# Altium project ZEPIC.PrjPcb (part 1 of 2)
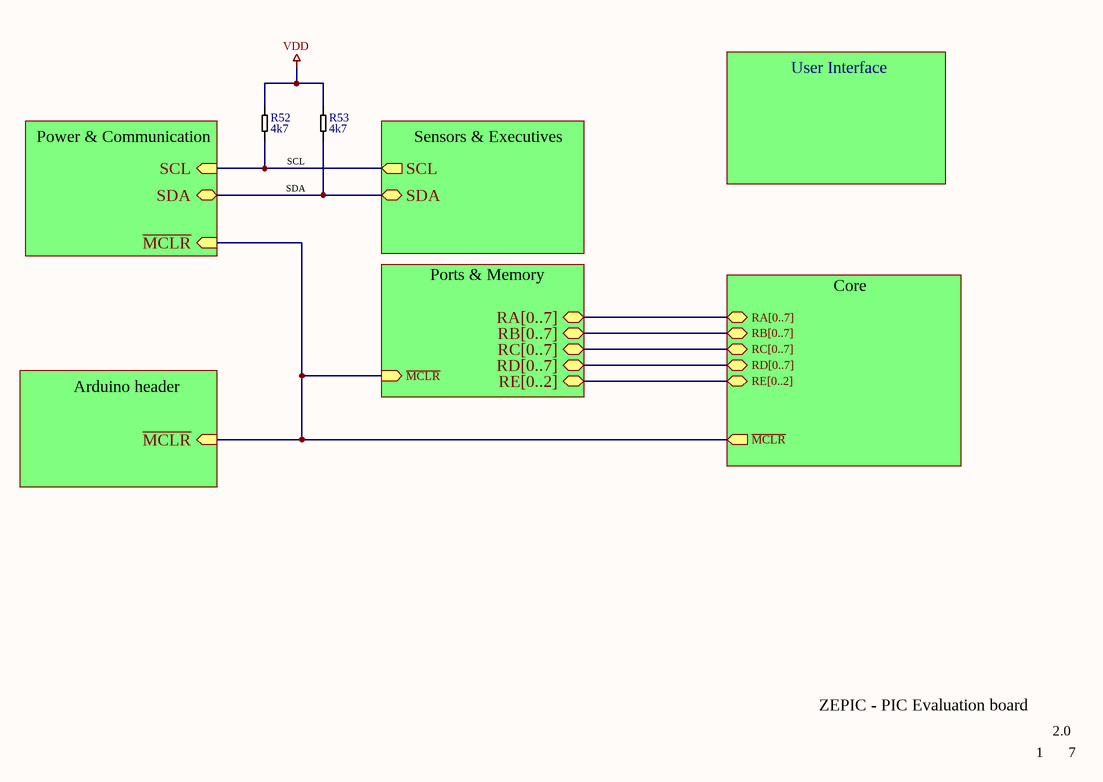
[diagram p0: mainSheet.SchDoc]
7 sheets, 209 parts. Net scope: hierarchical (ports join the sheet entries above them; power ports are global).
Board file: zepic.PcbDoc
Sheets:
  mainSheet.SchDoc
    Power & Communication = powerAndCommunication.SchDoc
    Core = core.SchDoc
    Arduino header = arduinoHeader.SchDoc
    User Interface = userInterface.SchDoc
    Ports & Memory = portsAndMemory.SchDoc
    Sensors & Executives = sensorsAndExecutiveElements.SchDoc

## Sheet mainSheet.SchDoc
size A4

### Parts
R52  Resistance: 4k7  [0805]  (hidden comment: Resistor)
R53  Resistance: 4k7  [0805]  (hidden comment: Resistor)

### Sub-sheets
Arduino header = arduinoHeader.SchDoc: ~{MCLR} (in)
Core = core.SchDoc: ~{MCLR} (out), RE[0..2] (bidir), RD[0..7] (bidir), RC[0..7] (bidir), RB[0..7] (bidir), RA[0..7] (bidir)
Ports & Memory = portsAndMemory.SchDoc: RE[0..2] (bidir), RD[0..7] (bidir), RC[0..7] (bidir), RB[0..7] (bidir), RA[0..7] (bidir), ~{MCLR} (in)
Power & Communication = powerAndCommunication.SchDoc: ~{MCLR} (in), SCL (in), SDA (bidir)
Sensors & Executives = sensorsAndExecutiveElements.SchDoc: SCL (out), SDA (bidir)
User Interface = userInterface.SchDoc: no entries

### Nets
VDD: R52.1 R53.1
~{MCLR}: sheet Power & Communication/~{MCLR}, sheet Core/~{MCLR}, sheet Arduino header/~{MCLR}, sheet Ports & Memory/~{MCLR}
SCL: R52.2 ; sheet Power & Communication/SCL, sheet Sensors & Executives/SCL
SDA: R53.2 ; sheet Power & Communication/SDA, sheet Sensors & Executives/SDA

### Buses and harness runs
bus sheet Core/RA[0..7] = sheet Ports & Memory/RA[0..7]
bus sheet Core/RB[0..7] = sheet Ports & Memory/RB[0..7]
bus sheet Core/RC[0..7] = sheet Ports & Memory/RC[0..7]
bus sheet Core/RD[0..7] = sheet Ports & Memory/RD[0..7]
bus sheet Core/RE[0..2] = sheet Ports & Memory/RE[0..2]

### Notes on the sheet
- ZEPIC - PIC Evaluation board
- 1
- 2.0
- 7
- Title:
- Size:
- Date:
- A4
- Number:
- Time:
- Revision:
- Sheet
- of
- Author:
- Krzysztof Pierczyk
- File:

### Library data of the parts
R52 R53 = Resistor: Nominal power: 125mW

## Sheet powerAndCommunication.SchDoc
size A4
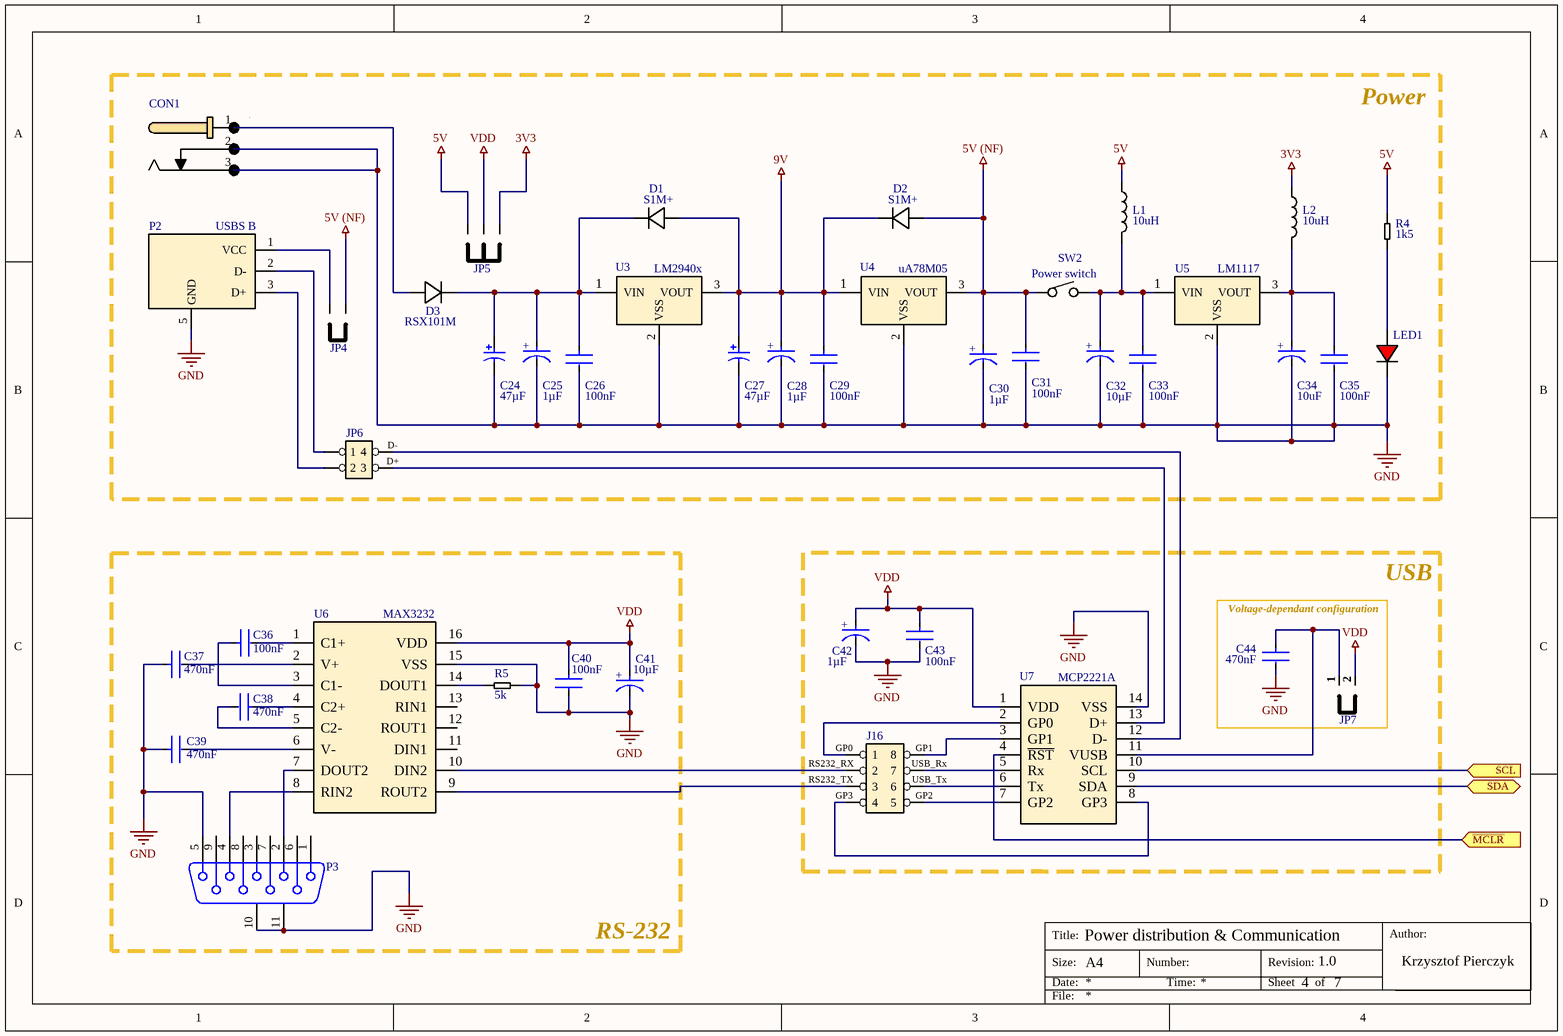
[diagram p1: powerAndCommunication.SchDoc]

### Parts
C24  Capacitance: 47µF  [PNSC-EEE-FK1V331P_L]  (hidden comment: EEE-FK1V331P)
C25  Capacitance: 1µF  [FP-F98S-MFG]  (hidden comment: F981C106MSAAS1)
C26  value 100nF  [FP-C0805C-DN-MFG]  (hidden comment: C0805C102J5GACTU)
C27  Capacitance: 47µF  [PNSC-EEE-FK1V331P_L]  (hidden comment: EEE-FK1V331P)
C28  Capacitance: 1µF  [FP-F98S-MFG]  (hidden comment: F981C106MSAAS1)
C29  value 100nF  [FP-C0805C-DN-MFG]  (hidden comment: C0805C102J5GACTU)
C30  Capacitance: 1µF  [FP-F98S-MFG]  (hidden comment: F981C106MSAAS1)
C31  value 100nF  [FP-C0805C-DN-MFG]  (hidden comment: C0805C102J5GACTU)
C32  Capacitance: 10µF  [FP-F98S-MFG]  (hidden comment: F981C106MSAAS1)
C33  value 100nF  [FP-C0805C-DN-MFG]  (hidden comment: C0805C102J5GACTU)
C34  Capacitance: 10uF  [FP-F98S-MFG]  (hidden comment: F981C106MSAAS1)
C35  value 100nF  [FP-C0805C-DN-MFG]  (hidden comment: C0805C102J5GACTU)
C36  value 100nF  [FP-C0805C-DN-MFG]  (hidden comment: C0805C102J5GACTU)
C37  value 470nF  [FP-C0805C-DN-MFG]  (hidden comment: C0805C102J5GACTU)
C38  value 470nF  [FP-C0805C-DN-MFG]  (hidden comment: C0805C102J5GACTU)
C39  value 470nF  [FP-C0805C-DN-MFG]  (hidden comment: C0805C102J5GACTU)
C40  value 100nF  [FP-C0805C-DN-MFG]  (hidden comment: C0805C102J5GACTU)
C41  Capacitance: 10µF  [FP-F98S-MFG]  (hidden comment: F981C106MSAAS1)
C42  Capacitance: 1µF  [FP-F98S-MFG]  (hidden comment: F981C106MSAAS1)
C43  value 100nF  [FP-C0805C-DN-MFG]  (hidden comment: C0805C102J5GACTU)
C44  value 470nF  [FP-C0805C-DN-MFG]  (hidden comment: C0805C102J5GACTU)
CON1  FC681477  [FC681477]  (value not drawn)
D1  S1M+  [SMA]
D2  S1M+  [SMA]
D3  RSX101M  [SOD-123]
J16  Header 2x4  [Header 2x4]  (value not drawn)
JP4  JUMPER-2  [HDR1X2]  (value not drawn)
JP5  JUMPER-3  [HDR1X3]  (value not drawn)
JP6  Header 2x2  [Header 2x2]  (value not drawn)
JP7  JUMPER-2  [Header 1x2]  (value not drawn)
L1  Inductance: 10uH  [0805]  (hidden comment: NL05JTC100)
L2  Inductance: 10uH  [0805]  (hidden comment: NL05JTC100)
LED1  Red LED  [LED (0805)]  (value not drawn)
P2  USBS B  [USB B (female)]
P3  D Connector 9  [DSUB1.385-2H9]  (value not drawn)
R4  Resistance: 1k5  [0805]  (hidden comment: Resistor)
R5  Resistance: 5k  [0805]  (hidden comment: Resistor)
SW2  Power switch  [Switch 4.7mm (botland)]
U3  LM2940x  [TO-220 (H)]
U4  uA78M05  [TO-220 (H)]
U5  LM1117  [TO-220 (H)]
U6  MAX3232  [SOIC-16 (150mil)]
U7  MCP2221A  [SOIC-14]

### Blocks framed on the sheet
Power: C24-C35 CON1 D1-D3 JP4-JP6 L1 L2 LED1 P2 R4 SW2 U3-U5
RS-232: C36-C41 P3 R5 U6
Voltage-dependant configuration: C42 C43 J16 U7
USB: C44 JP7

### Ports
SCL (in), SDA (bidir), ~{MCLR} (in)

### Nets
3V3: JP5.3 L2.1
5V: JP5.1 L1.1 R4.1
5V (NF): C30.2(A) C31.1 D2.2 JP4.2 SW2.2(COM) U4.3(VOUT)
9V: C27.1 C28.2(A) C29.1 D1.2 D2.1 U3.3(VOUT) U4.1(VIN)
GND: C24.2 C25.1(C) C26.2 C27.2 C28.1(C) C29.2 C30.1(C) C31.2 C32.1(C) C33.2 C34.1(C) C35.2 C37.1 C39.1 C40.2 C41.1(C) C42.1(C) C43.2 C44.2 CON1.2 CON1.3 LED1.2 P2.5(GND) P3.5 P3.10(MH1) P3.11(MH2) R5.2 U3.2(VSS) U4.2(VSS) U5.2(VSS) U6.15(VSS) U7.14(VSS)
VDD: C40.1 C41.2(A) C42.2(A) C43.1 JP5.2 JP7.2 U6.16(VDD) U7.1(VDD)
D+: JP6.3 U7.13(D+)
D-: JP6.4 U7.12(D-)
GP0: J16.1 U7.2(GP0)
GP1: J16.8 U7.3(GP1)
GP2: J16.5 U7.7(GP2)
GP3: J16.4 U7.8(GP3)
~{MCLR}: U7.4(~{RST}) ; port ~{MCLR}
RS232_RX: J16.2 U6.10(DIN2)
RS232_TX: J16.3 U6.9(ROUT2)
SCL: U7.10(SCL) ; port SCL
SDA: U7.9(SDA) ; port SDA
USB_Rx: J16.7 U7.5(Rx)
USB_Tx: J16.6 U7.6(Tx)
NetC24_1: C24.1 C25.2(A) C26.1 D1.1 D3.2 U3.1(VIN)
NetC32_2: C32.2(A) C33.1 L1.2 SW2.1 U5.1(VIN)
NetC34_2: C34.2(A) C35.1 L2.2 U5.3(VOUT)
NetC36_1: C36.1 U6.3(C1-)
NetC36_2: C36.2 U6.1(C1+)
NetC37_2: C37.2 U6.2(V+)
NetC38_1: C38.1 U6.4(C2+)
NetC38_2: C38.2 U6.5(C2-)
NetC39_2: C39.2 U6.6(V-)
NetC44_1: C44.1 JP7.1 U7.11(VUSB)
NetCON1_1: CON1.1 D3.1
NetJP4_1: JP4.1 P2.1(VCC)
NetJP6_1: JP6.1 P2.2(D-)
NetJP6_2: JP6.2 P2.3(D+)
NetLED1_1: LED1.1 R4.2
NetP3_2: P3.2 U6.7(DOUT2)
NetP3_4: P3.4 U6.8(RIN2)
NetR5_1: R5.1 U6.14(DOUT1)

Not connected (* = marked no-connect by the designer): P3 1 3 6 7 8 9; U6 11(DIN1) 12(ROUT1) 13(RIN1)

### Notes on the sheet
- Power distribution & Communication
- 4
- 1.0
- 7
- Title:
- Size:
- Date:
- A4
- Number:
- Time:
- Revision:
- Sheet
- of
- Author:
- Krzysztof Pierczyk
- File:
- (in symbol CMP-04424-000018-1) +

### Library data of the parts
C24 C27 = CMP-2000-06212-1: Aluminum Electrolytic Capacitor, 330 uF, 35 V, -55 to 105 degC, 2-Pin CAPAE, RoHS, Tape and Reel; Manufacturer: Panasonic; Type: Can; Impedance: 0.08O; Ripple Current: 850mA; Lifetime@Temperature: 2000Hrs@105°C; Rated Voltage: 35V; Datasheet Version: 07/2008; Manufacturer URL: http://www.panasonic.com/; Package Description: 2-Pin Capacitor Aluminum Electrolytic, Body 10.3 x 10.3 mm, Height 10.5 mm; Case Size/Dimension: Ø10x10.2mm; Datasheet URL: https://datasheet.ciiva.com/29313/443481-da-01-en-smd-elko-vfk-g-330-uf-35v-29313592.pdf; Series: FK; Mounting Technology: SurfaceMount; Package Reference: EEE-FK1V331P; Operating Temp-Max: 105°C; Operating Temp Range: -55to+105°C
C25 C28 C30 C32 C34 C41 C42 = CMP-04424-000018-1: CAP TANT 10UF 20% 16V 0805; Manufacturer: AVX; Esr: 4.5Ω; Material: Tantalum; Ripple Current: 100mA; Leakage Current: 1.6uA; Life: 1000Hours; Dissipation Factor: 18%; Temperature Range High: +125°C; Temperature: -55°C to +125°C; Digikey Description: CAP TANT 10UF 20% 16V 0805; Tolerance: 20%; Automotive: No; Voltage Rating: 16V; Device Class L3: Tantalum Capacitors; Package: F98S; Device Class L2: Capacitors; Footprint Url: https://www.avx.com/download/software/literature/AVX-Footprint-Library.pdf; Mouser Description: Cap Tant Solid 10uF 16V S CASE 20% (2 x 1.25 x 0.8mm) SMD 2012-09 4.5Ohm 125°C T/R; Value: 10uF; ComponentLink2URL: http://datasheets.avx.com/F98-AS1.pdf; Height: 0.9mm; Manufacturer Part Number: F981C106MSAAS1; ComponentLink2Description: Datasheet; Lead Free: Yes; Category: Cap; Temperature Coefficient: 20%; RoHS: TRUE; Temperature Range Low: -55°C; Octopart: https://octopart.com/f981c106msaas1-avx-49645945; Device Class L1: Passive Components
C26 C29 C31 C33 C35-C40 C43 C44 = CMP-03020-008364-1: CAP CER 1000PF 50V C0G/NP0 0805; Manufacturer: KEMET; Capacitance: 1,000 pF; Temperature Characteristic: C0G; Material: Ceramic; Temperature Coefficient: 30ppm/°C; Tolerance: 0.05; Automotive: No; Voltage Rating: 50 V; Device Class L1: Passive Components; Digikey Description: CAP CER 1000PF 50V C0G/NP0 0805; Lead Free: Yes; Package: C0805C-DN; RoHS: TRUE; Temperature Range High: +125°C; Height: 0.88mm; Ipc Land Pattern Name: CAPC200125X78; Category: Cap; ComponentLink2URL: https://content.kemet.com/datasheets/KEM_C1003_C0G_SMD.pdf; Device Class L2: Capacitors; ComponentLink2Description: Datasheet; Temperature: -55°C to +125°C; Octopart: https://octopart.com/c0805c102j5gactu-kemet-97757; Mouser Description: Multilayer Ceramic Capacitors MLCC - SMD/SMT 50volts 1000pF C0G 5%; Manufacturer Part Number: C0805C102J5GACTU; Device Class L3: Ceramic Capacitors; Temperature Range Low: -55°C
CON1 = DC Jack: Rating: 12V / 2A; ComponentLink1Description: Datasheet; ComponentLink1URL: http://www.farnell.com/datasheets/2607082.pdf?_ga=2.241941314.1193962280.1589558354-303286379.1586364067&_gac=1.189249881.1589563198.Cj0KCQjw-_j1BRDkARIsAJcfmTFIG7O-lBwUzM7jXL1d54rcmK8ZCJrBZphKUIU-ia_1DnqilNgsh1YaAq1qEALw_wcB
D1 D2 = S1M+_1: V_reverse (max): 1000V; I_forward (max): 1A; V_forward (max): 1.1V; ComponentLink1Description: Datasheet; ComponentLink1URL: http://www.farnell.com/datasheets/2863963.pdf?_ga=2.217691222.1193962280.1589558354-303286379.1586364067&_gac=1.191757912.1589563198.Cj0KCQjw-_j1BRDkARIsAJcfmTFIG7O-lBwUzM7jXL1d54rcmK8ZCJrBZphKUIU-ia_1DnqilNgsh1YaAq1qEALw_wcB
D3 = RSX101M-30TR: Vf (max): 350mV; If (max): 1A
L1 L2 = Coil: SMD coil; Tolerance: +/- 20%; Impedance (DCR): 100mohm; Rated current: 1.44A; ComponentLink1Description: Datasheet; ComponentLink1URL: https://www.piekarz.pl/pdf.php?id=28071
LED1 = Red LED: Nominal current: 2mA; Nominal voltage: 1.95V; ComponentLink1Description: Datasheet; ComponentLink1URL: http://www.farnell.com/datasheets/2863963.pdf?_ga=2.217691222.1193962280.1589558354-303286379.1586364067&_gac=1.191757912.1589563198.Cj0KCQjw-_j1BRDkARIsAJcfmTFIG7O-lBwUzM7jXL1d54rcmK8ZCJrBZphKUIU-ia_1DnqilNgsh1YaAq1qEALw_wcB
P2 = LUMBERG241103: ComponentLink1Description: Datasheet; ComponentLink1URL: http://www.farnell.com/datasheets/2632919.pdf?_ga=2.217691222.1193962280.1589558354-303286379.1586364067&_gac=1.191757912.1589563198.Cj0KCQjw-_j1BRDkARIsAJcfmTFIG7O-lBwUzM7jXL1d54rcmK8ZCJrBZphKUIU-ia_1DnqilNgsh1YaAq1qEALw_wcB
P3 = D Connector 9: Receptacle Assembly, 9 Position, Right Angle; PackageDocument: O; Positions: 9; Published: 15-Jun-2001; LatestRevisionDate: 17-Jul-2002; LatestRevisionNote: Re-released for DXP Platform.; DatasheetDocument: 1-Sep-1999; PackageReference: 788750; Publisher: Altium Limited; Orientation: Right Angle; Gender: Receptacle
R4 R5 = Resistor: Nominal power: 125mW
SW2 = Double switch
U3 = LM2940x: VIN (min): 10.5V; VIN (max): 26V; VOUT: 9V; IOUT (max): 1A; I_Quiescent (max): 20mA; ComponentLink1Description: Datasheet; ComponentLink1URL: http://www.ti.com/lit/ds/symlink/lm2940-n.pdf?&ts=1589639085194
U4 = uA78M05: VIN (min): 7V; VIN (max): 25V; VOUT: 5V; IOUT (max): 500mA; I_Quiescent (max): 6mA; ComponentLink1Description: Datasheet; ComponentLink1URL: http://www.ti.com/lit/ds/symlink/ua78m.pdf?&ts=1589638247503
U5 = LM1117: VIN (min): 4.75V; VIN (max): 15V; VOUT: 3.3V; IOUT (max): 800mA; I_Quiescent (max): 10mA; ComponentLink1Description: Datasheet; ComponentLink1URL: http://www.ti.com/lit/ds/symlink/ua78m.pdf?&ts=1589638247503
U6 = MAX3232: VDD (min): 3V; VDD (max): 5.5V; IDD: 1mA; ComponentLink1Description: Datasheet; ComponentLink1URL: http://www.ti.com/lit/ds/symlink/max3232.pdf?&ts=1589636660726
U7 = MCP2221A: VDD (min): 3.0V; VDD (max): 5.5V; ICC (max): 15mA; ComponentLink1Description: Datasheet; ComponentLink1URL: http://ww1.microchip.com/downloads/en/devicedoc/20005565b.pdf

## Sheet core.SchDoc
size A4
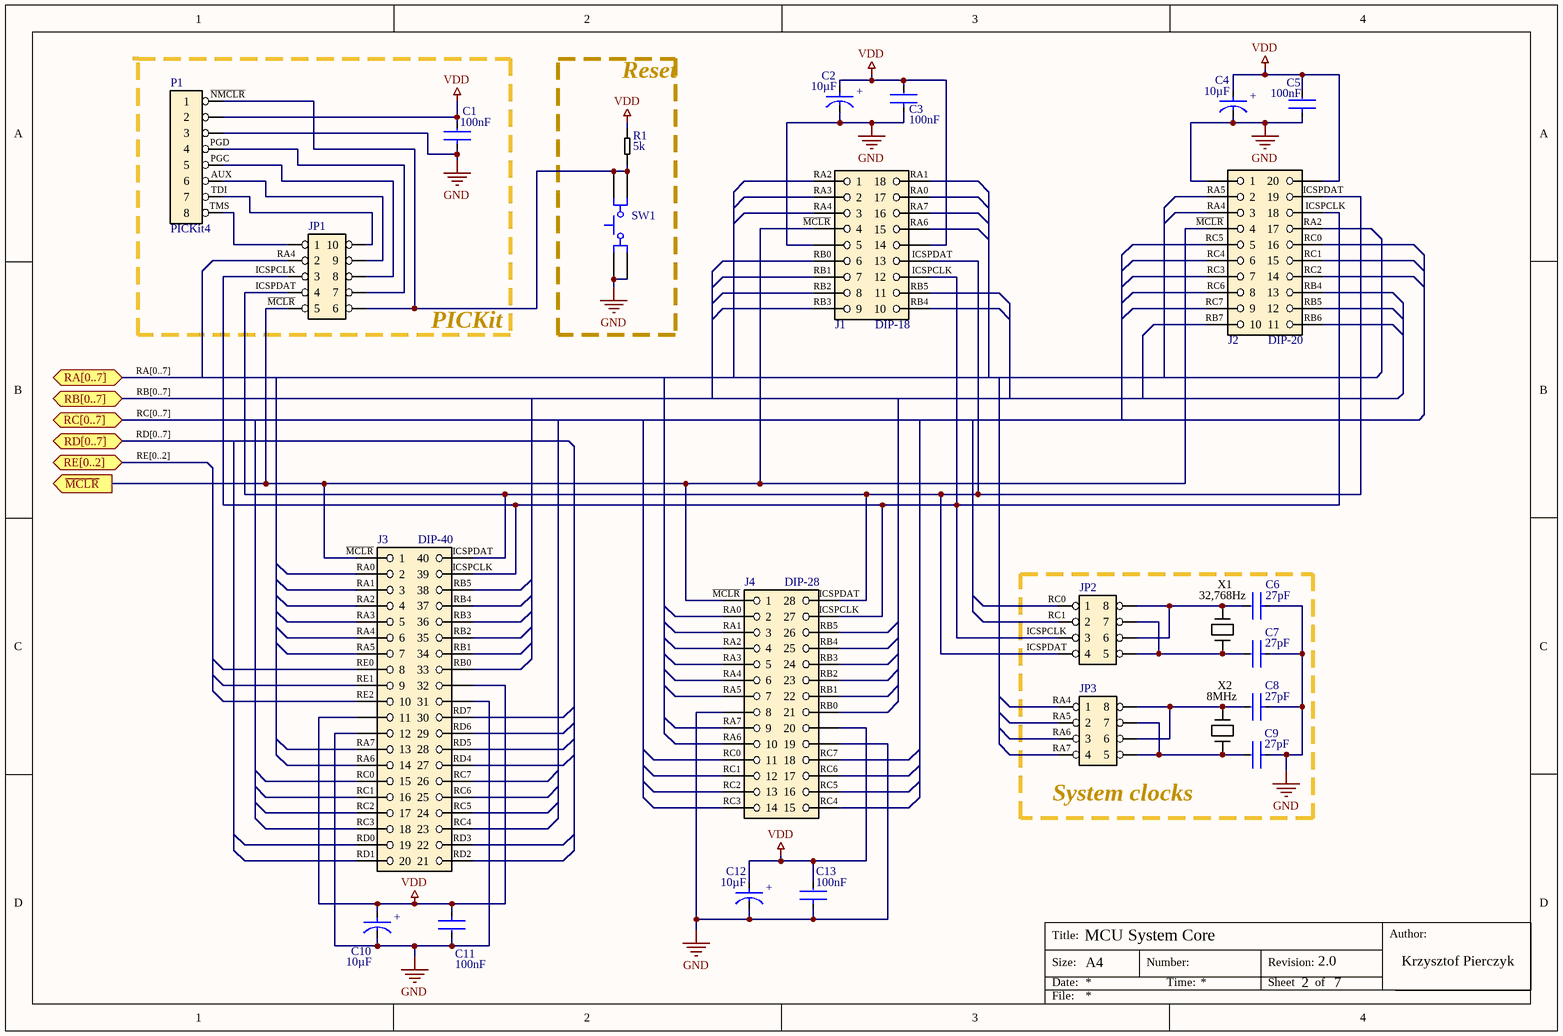
[diagram p2: core.SchDoc]

### Parts
C1  value 100nF  [FP-C0805C-DN-MFG]  (hidden comment: C0805C102J5GACTU)
C2  Capacitance: 10µF  [FP-F98S-MFG]  (hidden comment: F981C106MSAAS1)
C3  value 100nF  [FP-C0805C-DN-MFG]  (hidden comment: C0805C102J5GACTU)
C4  Capacitance: 10µF  [FP-F98S-MFG]  (hidden comment: F981C106MSAAS1)
C5  value 100nF  [FP-C0805C-DN-MFG]  (hidden comment: C0805C102J5GACTU)
C6  value 27pF  [FP-C0805C-DN-MFG]  (hidden comment: C0805C102J5GACTU)
C7  value 27pF  [FP-C0805C-DN-MFG]  (hidden comment: C0805C102J5GACTU)
C8  value 27pF  [FP-C0805C-DN-MFG]  (hidden comment: C0805C102J5GACTU)
C9  value 27pF  [FP-C0805C-DN-MFG]  (hidden comment: C0805C102J5GACTU)
C10  Capacitance: 10µF  [FP-F98S-MFG]  (hidden comment: F981C106MSAAS1)
C11  value 100nF  [FP-C0805C-DN-MFG]  (hidden comment: C0805C102J5GACTU)
C12  Capacitance: 10µF  [FP-F98S-MFG]  (hidden comment: F981C106MSAAS1)
C13  value 100nF  [FP-C0805C-DN-MFG]  (hidden comment: C0805C102J5GACTU)
J1  DIP-18  [DIP18]
J2  DIP-20  [DIP20]
J3  DIP-40  [DIP40]
J4  DIP-28  [DIP28]
JP1  Header 2x5  [Header2x5]  (value not drawn)
JP2  Header 2x4  [Header 2x4]  (value not drawn)
JP3  Header 2x4  [Header 2x4]  (value not drawn)
P1  PICKit4  [Header 1x8H]
R1  Resistance: 5k  [0805]  (hidden comment: Resistor)
SW1  4-1437565-1  [TECO-4-1437565-1_V]  (value not drawn)
X1  Frequency: 32,768Hz  [X32K768S315]  (hidden comment: Crystal)
X2  Frequency: 8MHz  [HC49SMP]  (hidden comment: Crystal)

### Blocks framed on the sheet
Reset: R1 SW1
System clocks: C6-C9 JP2 JP3 X1 X2

### Ports
RA[0..7] (bidir), RB[0..7] (bidir), RC[0..7] (bidir), RD[0..7] (bidir), RE[0..2] (bidir), ~{MCLR} (out)

### Nets
GND: C1.1 C2.1(C) C3.1 C4.1(C) C5.1 C6.1 C7.1 C8.1 C9.1 C10.1(C) C11.2 C12.1(C) C13.1 J1.5 J2.1 J3.12 J3.31 J4.8 J4.19 P1.3 SW1.1 SW1.2
VDD: C1.2 C2.2(A) C3.2 C4.2(A) C5.2 C10.2(A) C11.1 C12.2(A) C13.2 J1.14 J2.20 J3.11 J3.32 J4.20 P1.2 R1.1
AUX: JP1.9 P1.6
ICSPCLK: J1.12 J2.18 J3.39 J4.27 JP1.3 JP2.3
ICSPDAT: J1.13 J2.19 J3.40 J4.28 JP1.4 JP2.4
~{MCLR}: J1.4 J2.4 J3.1 J4.1 JP1.5 ; port ~{MCLR}
~{NMCLR}: JP1.6 P1.1 R1.2 SW1.3 SW1.4
PGC: JP1.8 P1.5
PGD: JP1.7 P1.4
RA0: J1.17 J3.2 J4.2
RA1: J1.18 J3.3 J4.3
RA2: J1.1 J2.17 J3.4 J4.4
RA3: J1.2 J3.5 J4.5
RA4: J1.3 J2.3 J3.6 J4.6 JP1.2 JP3.1
RA5: J2.2 J3.7 J4.7 JP3.2
RA6: J1.15 J3.14 J4.10 JP3.3
RA7: J1.16 J3.13 J4.9 JP3.4
RB0: J1.6 J3.33 J4.21
RB1: J1.7 J3.34 J4.22
RB2: J1.8 J3.35 J4.23
RB3: J1.9 J3.36 J4.24
RB4: J1.10 J2.13 J3.37 J4.25
RB5: J1.11 J2.12 J3.38 J4.26
RB6: J2.11
RB7: J2.10
RC0: J2.16 J3.15 J4.11 JP2.1
RC1: J2.15 J3.16 J4.12 JP2.2
RC2: J2.14 J3.17 J4.13
RC3: J2.7 J3.18 J4.14
RC4: J2.6 J3.23 J4.15
RC5: J2.5 J3.24 J4.16
RC6: J2.8 J3.25 J4.17
RC7: J2.9 J3.26 J4.18
RD0: J3.19
RD1: J3.20
RD2: J3.21
RD3: J3.22
RD4: J3.27
RD5: J3.28
RD6: J3.29
RD7: J3.30
RE0: J3.8
RE1: J3.9
RE2: J3.10
TDI: JP1.10 P1.7
TMS: JP1.1 P1.8
NetC6_2: C6.2 JP2.6 JP2.8 X1.1
NetC7_2: C7.2 JP2.5 JP2.7 X1.2
NetC8_2: C8.2 JP3.6 JP3.8 X2.1
NetC9_2: C9.2 JP3.5 JP3.7 X2.2

### Buses and harness runs
bus RA[0..7] = port RA[0..7]
bus RB[0..7] = port RB[0..7]
bus RC[0..7] = port RC[0..7]
bus RD[0..7] = port RD[0..7]
bus RE[0..2] = port RE[0..2]

### Notes on the sheet
- PICKit
- MCU System Core
- 2
- 2.0
- 7
- Title:
- Size:
- Date:
- A4
- Number:
- Time:
- Revision:
- Sheet
- of
- Author:
- Krzysztof Pierczyk
- File:
- (in symbol CMP-04424-000018-1) +

### Library data of the parts
C1 C3 C5-C9 C11 C13 = CMP-03020-008364-1: as C26 on sheet powerAndCommunication; Automotive: No; Voltage Rating: 50 V; Device Class L1: Passive Components; Digikey Description: CAP CER 1000PF 50V C0G/NP0 0805; Lead Free: Yes; Package: C0805C-DN; RoHS: TRUE; Temperature Range High: +125°C; Height: 0.88mm; Ipc Land Pattern Name: CAPC200125X78; Category: Cap; ComponentLink2URL: https://content.kemet.com/datasheets/KEM_C1003_C0G_SMD.pdf; Device Class L2: Capacitors; ComponentLink2Description: Datasheet; Temperature: -55°C to +125°C; Octopart: https://octopart.com/c0805c102j5gactu-kemet-97757; Mouser Description: Multilayer Ceramic Capacitors MLCC - SMD/SMT 50volts 1000pF C0G 5%; Manufacturer Part Number: C0805C102J5GACTU; Device Class L3: Ceramic Capacitors; Temperature Range Low: -55°C
C2 C4 C10 C12 = CMP-04424-000018-1: as C25 on sheet powerAndCommunication; Temperature Range High: +125°C; Temperature: -55°C to +125°C; Digikey Description: CAP TANT 10UF 20% 16V 0805; Tolerance: 20%; Automotive: No; Voltage Rating: 16V; Device Class L3: Tantalum Capacitors; Package: F98S; Device Class L2: Capacitors; Footprint Url: https://www.avx.com/download/software/literature/AVX-Footprint-Library.pdf; Mouser Description: Cap Tant Solid 10uF 16V S CASE 20% (2 x 1.25 x 0.8mm) SMD 2012-09 4.5Ohm 125°C T/R; Value: 10uF; ComponentLink2URL: http://datasheets.avx.com/F98-AS1.pdf; Height: 0.9mm; Manufacturer Part Number: F981C106MSAAS1; ComponentLink2Description: Datasheet; Lead Free: Yes; Category: Cap; Temperature Coefficient: 20%; RoHS: TRUE; Temperature Range Low: -55°C; Octopart: https://octopart.com/f981c106msaas1-avx-49645945; Device Class L1: Passive Components
J1 = DIP-18: Current rating: 1A; Voltage rating: 100V; Contact resistance (max): 15mohm; ComponentLink1Description: Datasheet; ComponentLink1URL: http://www.farnell.com/datasheets/2945665.pdf?_ga=2.253269833.1193962280.1589558354-303286379.1586364067&_gac=1.195417566.1589563198.Cj0KCQjw-_j1BRDkARIsAJcfmTFIG7O-lBwUzM7jXL1d54rcmK8ZCJrBZphKUIU-ia_1DnqilNgsh1YaAq1qEALw_wcB
J2 = DIP-20: Current rating: 1A; Voltage rating: 100V; Contact resistance (max): 15mohm; ComponentLink1Description: Datasheet; ComponentLink1URL: http://www.farnell.com/datasheets/2945665.pdf?_ga=2.253269833.1193962280.1589558354-303286379.1586364067&_gac=1.195417566.1589563198.Cj0KCQjw-_j1BRDkARIsAJcfmTFIG7O-lBwUzM7jXL1d54rcmK8ZCJrBZphKUIU-ia_1DnqilNgsh1YaAq1qEALw_wcB
J3 = DIP-40: Current rating: 1A; Voltage rating: 100V; Contact resistance (max): 15mohm; ComponentLink1Description: Datasheet; ComponentLink1URL: http://www.farnell.com/datasheets/2945665.pdf?_ga=2.253269833.1193962280.1589558354-303286379.1586364067&_gac=1.195417566.1589563198.Cj0KCQjw-_j1BRDkARIsAJcfmTFIG7O-lBwUzM7jXL1d54rcmK8ZCJrBZphKUIU-ia_1DnqilNgsh1YaAq1qEALw_wcB
J4 = DIP-28: Current rating: 1A; Voltage rating: 100V; Contact resistance (max): 15mohm; ComponentLink1Description: Datasheet; ComponentLink1URL: http://www.farnell.com/datasheets/2945665.pdf?_ga=2.253269833.1193962280.1589558354-303286379.1586364067&_gac=1.195417566.1589563198.Cj0KCQjw-_j1BRDkARIsAJcfmTFIG7O-lBwUzM7jXL1d54rcmK8ZCJrBZphKUIU-ia_1DnqilNgsh1YaAq1qEALw_wcB
P1 = Header 1x8 A
R1 = Resistor: Nominal power: 125mW
SW1 = CMP-2000-05602-1: Tactile Switch, 50 mA, 12 VDC, -20 to 85 degC, 4-Pin SMD, RoHS, Bulk; Manufacturer: TEConnectivity/AMPBrand; Illumination Type: N/R; Maximum Contact Resistance: 100mOhm; Actuator Style: RoundButton; Actuator Length: 1.4mm; Contact Rating @ Voltage: 0.05@12VDCA; Maximum DC Voltage Rating: 12V; Body Orientation: Straight; Ground Terminal: No; Dielectric Strength: 500VAC; Operating Force: 1.57N; Electrical Life: 100000Cycle; Mechanical Life: N/A; Family: FSMJSMA; Contact Material: CopperAlloy; Type: N/A; RoHS: Yes; Pole Throw Configuration: N/A; Operating Temperature: -20to85C; Minimum Insulation Resistance: 100MOhm; Package Description: 4-Pin Surface Mount Device, Body 6 x 6 mm, Pitch 9.1 mm; Housing Material: N/A; Switch Configuration: N/A; Mounting: SurfaceMount,GullWing; Datasheet URL: https://datasheet.ciiva.com/14635/0900766b80912216-14635826.pdf; Packaging: Bulk; Base Material: N/A; Actuator Color: N/A; Dimension: 6x10x5.25mm; Contact Plating: Silver; Seal Location: N/A; Mounting Technology: SurfaceMount; Part No: 4-1437565-1; Seal Description: N/A; Maximum AC Voltage Rating: N/A; Datasheet Version: 04/2007; Manufacturer URL: http://www.te.com/; Package Reference: 4-1437565-1; Product Weight: N/A
X1 X2 = Crystal: ComponentLink1Description: Datasheet; ComponentLink1URL: https://www.4timing.com/specification/hc49smp.pdf

## Sheet arduinoHeader.SchDoc
size A4
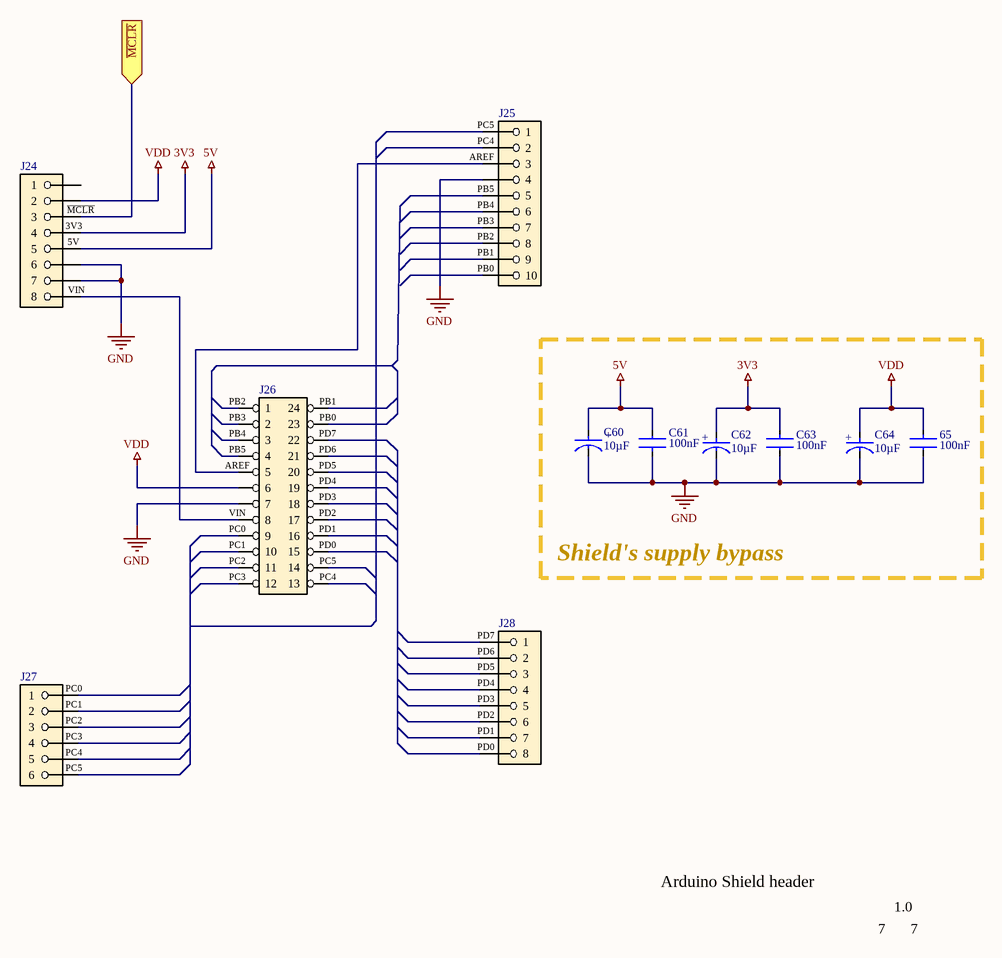
[diagram p3: arduinoHeader.SchDoc]

### Parts
65  value 100nF  [FP-C0805C-DN-MFG]  (hidden comment: C0805C102J5GACTU)
C60  Capacitance: 10µF  [FP-F98S-MFG]  (hidden comment: F981C106MSAAS1)
C61  value 100nF  [FP-C0805C-DN-MFG]  (hidden comment: C0805C102J5GACTU)
C62  Capacitance: 10µF  [FP-F98S-MFG]  (hidden comment: F981C106MSAAS1)
C63  value 100nF  [FP-C0805C-DN-MFG]  (hidden comment: C0805C102J5GACTU)
C64  Capacitance: 10µF  [FP-F98S-MFG]  (hidden comment: F981C106MSAAS1)
J24  Header 1x8 F  [Header 1x8]  (value not drawn)
J25  Header 1x10 F  [Header 1x10]  (value not drawn)
J26  Header 2x12  [Header 2x12]  (value not drawn)
J27  Header 1x6 F  [Header 1x6]  (value not drawn)
J28  Header 1x8 F  [Header 1x8]  (value not drawn)

### Blocks framed on the sheet
Shield's supply bypass: 65 C60-C64

### Ports
~{MCLR} (in)

### Nets
3V3: C62.2(A) C63.1 J24.4
5V: C60.2(A) C61.2 J24.5
GND: 65.2 C60.1(C) C61.1 C62.1(C) C63.2 C64.1(C) J24.6 J24.7 J25.4 J26.7
VDD: 65.1 C64.2(A) J24.2 J26.6
AREF: J25.3 J26.5
~{MCLR}: J24.3 ; port ~{MCLR}
PB0: J25.10 J26.23
PB1: J25.9 J26.24
PB2: J25.8 J26.1
PB3: J25.7 J26.2
PB4: J25.6 J26.3
PB5: J25.5 J26.4
PC0: J26.9 J27.1
PC1: J26.10 J27.2
PC2: J26.11 J27.3
PC3: J26.12 J27.4
PC4: J25.2 J26.13 J27.5
PC5: J25.1 J26.14 J27.6
PD0: J26.15 J28.8
PD1: J26.16 J28.7
PD2: J26.17 J28.6
PD3: J26.18 J28.5
PD4: J26.19 J28.4
PD5: J26.20 J28.3
PD6: J26.21 J28.2
PD7: J26.22 J28.1
VIN: J24.8 J26.8

Not connected (* = marked no-connect by the designer): J24 1

### Notes on the sheet
- Arduino Shield header
- 7
- 1.0
- Title:
- Size:
- Date:
- A4
- Number:
- Time:
- Revision:
- Sheet
- of
- Author:
- Krzysztof Pierczyk
- File:
- (in symbol CMP-04424-000018-1) +

### Library data of the parts
65 = CMP-03020-008364-1: CAP CER 1000PF 50V C0G/NP0 0805; Manufacturer: KEMET; Capacitance: 1,000 pF; Temperature Characteristic: C0G; Temperature Coefficient: 30ppm/°C; Tolerance: 0.05; Automotive: No; Voltage Rating: 50 V; Device Class L1: Passive Components; Digikey Description: CAP CER 1000PF 50V C0G/NP0 0805; Lead Free: Yes; Package: C0805C-DN; RoHS: TRUE; Temperature Range High: +125°C; Height: 0.88mm; Ipc Land Pattern Name: CAPC200125X78; Category: Cap; ComponentLink2URL: https://content.kemet.com/datasheets/KEM_C1003_C0G_SMD.pdf; Device Class L2: Capacitors; ComponentLink2Description: Datasheet; Temperature: -55°C to +125°C; Octopart: https://octopart.com/c0805c102j5gactu-kemet-97757; Mouser Description: Multilayer Ceramic Capacitors MLCC - SMD/SMT 50volts 1000pF C0G 5%; Manufacturer Part Number: C0805C102J5GACTU; Material: Ceramic; Device Class L3: Ceramic Capacitors; Temperature Range Low: -55°C
C60 C62 C64 = CMP-04424-000018-1: as C25 on sheet powerAndCommunication; Temperature Range High: +125°C; Temperature: -55°C to +125°C; Digikey Description: CAP TANT 10UF 20% 16V 0805; Tolerance: 20%; Automotive: No; Voltage Rating: 16V; Device Class L3: Tantalum Capacitors; Package: F98S; Device Class L2: Capacitors; Footprint Url: https://www.avx.com/download/software/literature/AVX-Footprint-Library.pdf; Mouser Description: Cap Tant Solid 10uF 16V S CASE 20% (2 x 1.25 x 0.8mm) SMD 2012-09 4.5Ohm 125°C T/R; Value: 10uF; ComponentLink2URL: http://datasheets.avx.com/F98-AS1.pdf; Height: 0.9mm; Manufacturer Part Number: F981C106MSAAS1; ComponentLink2Description: Datasheet; Lead Free: Yes; Category: Cap; Temperature Coefficient: 20%; RoHS: TRUE; Temperature Range Low: -55°C; Octopart: https://octopart.com/f981c106msaas1-avx-49645945; Device Class L1: Passive Components
C61 C63 = CMP-03020-008364-1: as C26 on sheet powerAndCommunication; Automotive: No; Voltage Rating: 50 V; Device Class L1: Passive Components; Digikey Description: CAP CER 1000PF 50V C0G/NP0 0805; Lead Free: Yes; Package: C0805C-DN; RoHS: TRUE; Temperature Range High: +125°C; Height: 0.88mm; Ipc Land Pattern Name: CAPC200125X78; Category: Cap; ComponentLink2URL: https://content.kemet.com/datasheets/KEM_C1003_C0G_SMD.pdf; Device Class L2: Capacitors; ComponentLink2Description: Datasheet; Temperature: -55°C to +125°C; Octopart: https://octopart.com/c0805c102j5gactu-kemet-97757; Mouser Description: Multilayer Ceramic Capacitors MLCC - SMD/SMT 50volts 1000pF C0G 5%; Manufacturer Part Number: C0805C102J5GACTU; Device Class L3: Ceramic Capacitors; Temperature Range Low: -55°C

## Sheet userInterface.SchDoc
size A4
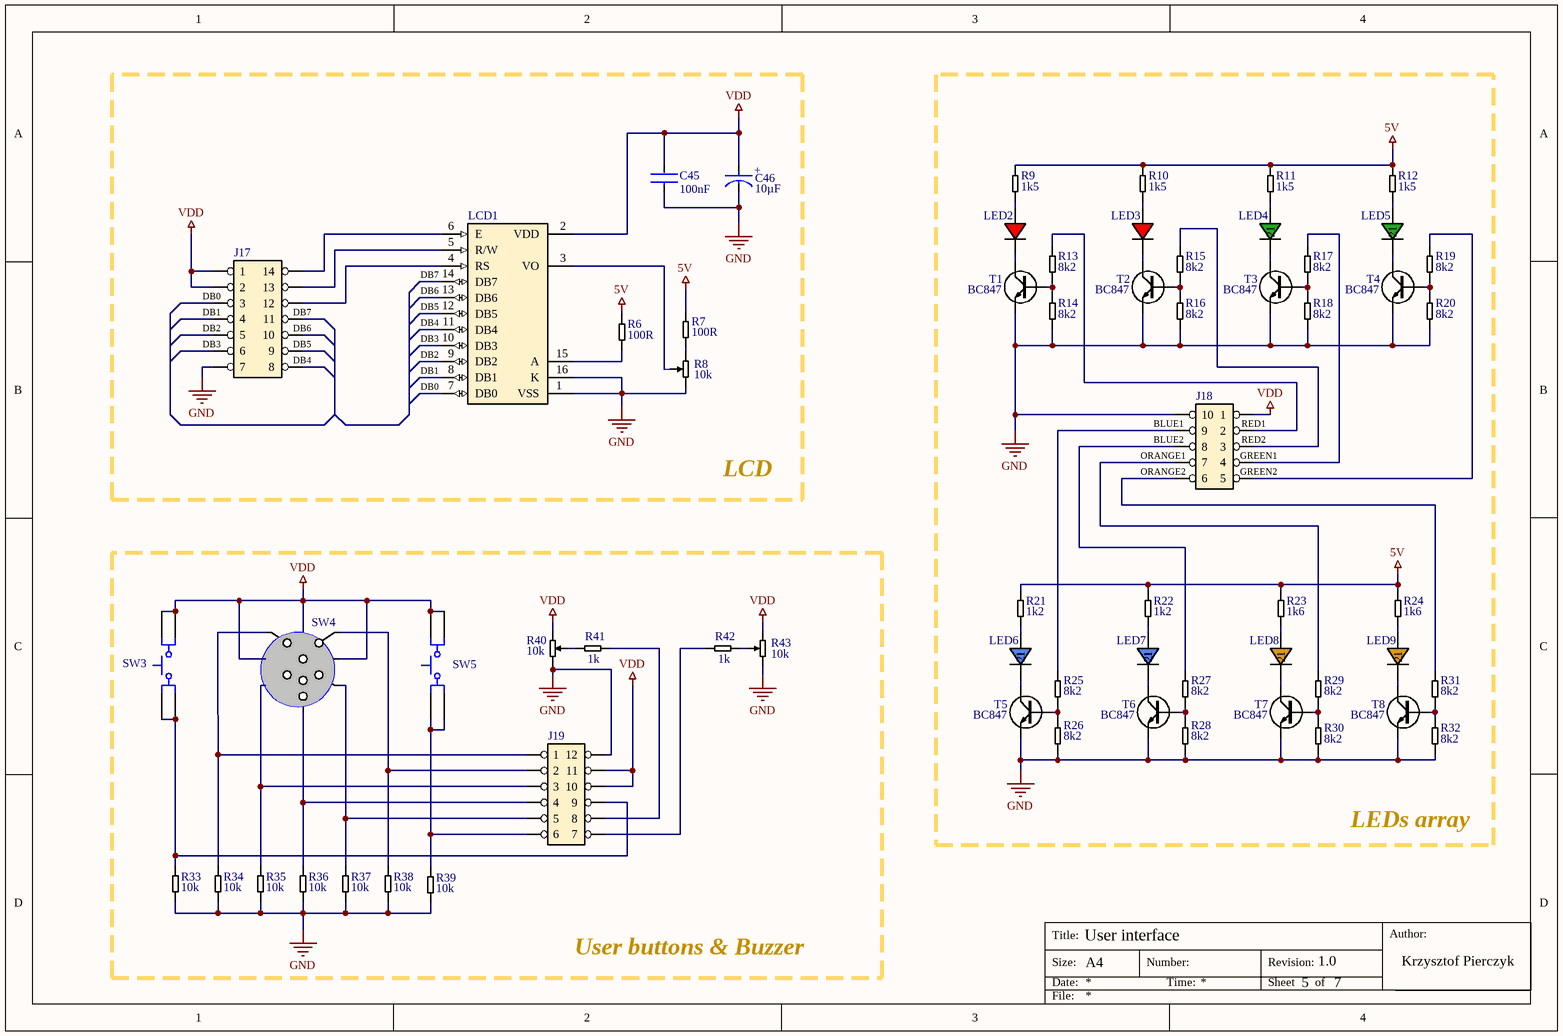
[diagram p4: userInterface.SchDoc]

### Parts
C45  value 100nF  [FP-C0805C-DN-MFG]  (hidden comment: C0805C102J5GACTU)
C46  Capacitance: 10µF  [FP-F98S-MFG]  (hidden comment: F981C106MSAAS1)
J17  Header 2x7  [Header 2x7]  (value not drawn)
J18  Header 2x5  [Header2x5]  (value not drawn)
J19  Header 2x6  [Header 2x6]  (value not drawn)
LCD1  LCD (16:2)  [LCD (16:2)]  (value not drawn)
LED2  Red LED  [LED (0805)]  (value not drawn)
LED3  Red LED  [LED (0805)]  (value not drawn)
LED4  Green LED  [LED (0805)]  (value not drawn)
LED5  Green LED  [LED (0805)]  (value not drawn)
LED6  Blue LED  [LED (0805)]  (value not drawn)
LED7  Blue LED  [LED (0805)]  (value not drawn)
LED8  Orange LED  [LED (0805)]  (value not drawn)
LED9  Orange LED  [LED (0805)]  (value not drawn)
R6  Resistance: 100R  [0805]  (hidden comment: Resistor)
R7  Resistance: 100R  [0805]  (hidden comment: Resistor)
R8  Resistance: 10k  [TM3FJ]  (hidden comment: Potentiometer)
R9  Resistance: 1k5  [0805]  (hidden comment: Resistor)
R10  Resistance: 1k5  [0805]  (hidden comment: Resistor)
R11  Resistance: 1k5  [0805]  (hidden comment: Resistor)
R12  Resistance: 1k5  [0805]  (hidden comment: Resistor)
R13  Resistance: 8k2  [0805]  (hidden comment: Resistor)
R14  Resistance: 8k2  [0805]  (hidden comment: Resistor)
R15  Resistance: 8k2  [0805]  (hidden comment: Resistor)
R16  Resistance: 8k2  [0805]  (hidden comment: Resistor)
R17  Resistance: 8k2  [0805]  (hidden comment: Resistor)
R18  Resistance: 8k2  [0805]  (hidden comment: Resistor)
R19  Resistance: 8k2  [0805]  (hidden comment: Resistor)
R20  Resistance: 8k2  [0805]  (hidden comment: Resistor)
R21  Resistance: 1k2  [0805]  (hidden comment: Resistor)
R22  Resistance: 1k2  [0805]  (hidden comment: Resistor)
R23  Resistance: 1k6  [0805]  (hidden comment: Resistor)
R24  Resistance: 1k6  [0805]  (hidden comment: Resistor)
R25  Resistance: 8k2  [0805]  (hidden comment: Resistor)
R26  Resistance: 8k2  [0805]  (hidden comment: Resistor)
R27  Resistance: 8k2  [0805]  (hidden comment: Resistor)
R28  Resistance: 8k2  [0805]  (hidden comment: Resistor)
R29  Resistance: 8k2  [0805]  (hidden comment: Resistor)
R30  Resistance: 8k2  [0805]  (hidden comment: Resistor)
R31  Resistance: 8k2  [0805]  (hidden comment: Resistor)
R32  Resistance: 8k2  [0805]  (hidden comment: Resistor)
R33  Resistance: 10k  [0805]  (hidden comment: Resistor)
R34  Resistance: 10k  [0805]  (hidden comment: Resistor)
R35  Resistance: 10k  [0805]  (hidden comment: Resistor)
R36  Resistance: 10k  [0805]  (hidden comment: Resistor)
R37  Resistance: 10k  [0805]  (hidden comment: Resistor)
R38  Resistance: 10k  [0805]  (hidden comment: Resistor)
R39  Resistance: 10k  [0805]  (hidden comment: Resistor)
R40  Resistance: 10k  [TM3FJ]  (hidden comment: Potentiometer)
R41  Resistance: 1k  [0805]  (hidden comment: Resistor)
R42  Resistance: 1k  [0805]  (hidden comment: Resistor)
R43  Resistance: 10k  [TM3FJ]  (hidden comment: Potentiometer)
SW3  4-1437565-1  [TECO-4-1437565-1_V]  (value not drawn)
SW4  KLS7-MT-01  [KLS-JOY-SW]  (value not drawn)
SW5  4-1437565-1  [TECO-4-1437565-1_V]  (value not drawn)
T1  BC847  [SOT-23-3]
T2  BC847  [SOT-23-3]
T3  BC847  [SOT-23-3]
T4  BC847  [SOT-23-3]
T5  BC847  [SOT-23-3]
T6  BC847  [SOT-23-3]
T7  BC847  [SOT-23-3]
T8  BC847  [SOT-23-3]

### Blocks framed on the sheet
LCD: C45 C46 J17 LCD1 R6-R8
LEDs array: J18 LED2-LED9 R9-R32 T1-T8
User buttons & Buzzer: J19 R33-R43 SW3-SW5

### Nets
5V: R6.2 R7.2 R9.2 R10.2 R11.2 R12.2 R21.2 R22.2 R23.2 R24.2
GND: C45.1 C46.1(C) J17.7 J18.10 J19.12 LCD1.1(VSS) LCD1.16(K) R8.2 R14.1 R16.1 R18.1 R20.1 R26.1 R28.1 R30.1 R32.1 R33.1 R34.1 R35.1 R36.1 R37.1 R38.1 R39.1 R40.2 R43.2 T1.2(E) T2.2(E) T3.2(E) T4.2(E) T5.2(E) T6.2(E) T7.2(E) T8.2(E)
VDD: C45.2 C46.2(A) J17.1 J17.2 J18.1 J19.10 J19.11 LCD1.2(VDD) R40.3 R43.3 SW3.3 SW3.4 SW4.5 SW4.7 SW4.8 SW5.3 SW5.4
BLUE1: J18.9 R25.1
BLUE2: J18.8 R27.2
DB0: J17.3 LCD1.7(DB0)
DB1: J17.4 LCD1.8(DB1)
DB2: J17.5 LCD1.9(DB2)
DB3: J17.6 LCD1.10(DB3)
DB4: J17.8 LCD1.11(DB4)
DB5: J17.9 LCD1.12(DB5)
DB6: J17.10 LCD1.13(DB6)
DB7: J17.11 LCD1.14(DB7)
GREEN1: J18.4 R17.2
GREEN2: J18.5 R19.2
ORANGE1: J18.7 R29.2
ORANGE2: J18.6 R31.2
RED1: J18.2 R13.2
RED2: J18.3 R15.2
NetJ17_12: J17.12 LCD1.4(RS)
NetJ17_13: J17.13 LCD1.5(R/W)
NetJ17_14: J17.14 LCD1.6(E)
NetJ19_1: J19.1 R34.2 SW4.4
NetJ19_2: J19.2 R38.2 SW4.6
NetJ19_3: J19.3 R35.2 SW4.1
NetJ19_4: J19.4 R36.2 SW4.2
NetJ19_5: J19.5 R37.2 SW4.3
NetJ19_6: J19.6 R39.2 SW5.1 SW5.2
NetJ19_7: J19.7 R42.1
NetJ19_8: J19.8 R41.2
NetJ19_9: J19.9 R33.2 SW3.1 SW3.2
NetLCD1_3: LCD1.3(VO) R8.1
NetLCD1_15: LCD1.15(A) R6.1
NetLED2_1: LED2.1 R9.1
NetLED2_2: LED2.2 T1.3(C)
NetLED3_1: LED3.1 R10.1
NetLED3_2: LED3.2 T2.3(C)
NetLED4_1: LED4.1 R11.1
NetLED4_2: LED4.2 T3.3(C)
NetLED5_1: LED5.1 R12.1
NetLED5_2: LED5.2 T4.3(C)
NetLED6_1: LED6.1 R21.1
NetLED6_2: LED6.2 T5.3(C)
NetLED7_1: LED7.1 R22.1
NetLED7_2: LED7.2 T6.3(C)
NetLED8_1: LED8.1 R23.1
NetLED8_2: LED8.2 T7.3(C)
NetLED9_1: LED9.1 R24.1
NetLED9_2: LED9.2 T8.3(C)
NetR7_1: R7.1 R8.3
NetR13_1: R13.1 R14.2 T1.1(B)
NetR15_1: R15.1 R16.2 T2.1(B)
NetR17_1: R17.1 R18.2 T3.1(B)
NetR19_1: R19.1 R20.2 T4.1(B)
NetR25_2: R25.2 R26.2 T5.1(B)
NetR27_1: R27.1 R28.2 T6.1(B)
NetR29_1: R29.1 R30.2 T7.1(B)
NetR31_1: R31.1 R32.2 T8.1(B)
NetR40_1: R40.1 R41.1
NetR42_2: R42.2 R43.1

### Notes on the sheet
- User interface
- 5
- 1.0
- 7
- Title:
- Size:
- Date:
- A4
- Number:
- Time:
- Revision:
- Sheet
- of
- Author:
- Krzysztof Pierczyk
- File:
- (in symbol CMP-04424-000018-1) +

### Library data of the parts
C45 = CMP-03020-008364-1: as C26 on sheet powerAndCommunication; Automotive: No; Voltage Rating: 50 V; Device Class L1: Passive Components; Digikey Description: CAP CER 1000PF 50V C0G/NP0 0805; Lead Free: Yes; Package: C0805C-DN; RoHS: TRUE; Temperature Range High: +125°C; Height: 0.88mm; Ipc Land Pattern Name: CAPC200125X78; Category: Cap; ComponentLink2URL: https://content.kemet.com/datasheets/KEM_C1003_C0G_SMD.pdf; Device Class L2: Capacitors; ComponentLink2Description: Datasheet; Temperature: -55°C to +125°C; Octopart: https://octopart.com/c0805c102j5gactu-kemet-97757; Mouser Description: Multilayer Ceramic Capacitors MLCC - SMD/SMT 50volts 1000pF C0G 5%; Manufacturer Part Number: C0805C102J5GACTU; Device Class L3: Ceramic Capacitors; Temperature Range Low: -55°C
C46 = CMP-04424-000018-1: as C25 on sheet powerAndCommunication; Temperature Range High: +125°C; Temperature: -55°C to +125°C; Digikey Description: CAP TANT 10UF 20% 16V 0805; Tolerance: 20%; Automotive: No; Voltage Rating: 16V; Device Class L3: Tantalum Capacitors; Package: F98S; Device Class L2: Capacitors; Footprint Url: https://www.avx.com/download/software/literature/AVX-Footprint-Library.pdf; Mouser Description: Cap Tant Solid 10uF 16V S CASE 20% (2 x 1.25 x 0.8mm) SMD 2012-09 4.5Ohm 125°C T/R; Value: 10uF; ComponentLink2URL: http://datasheets.avx.com/F98-AS1.pdf; Height: 0.9mm; Manufacturer Part Number: F981C106MSAAS1; ComponentLink2Description: Datasheet; Lead Free: Yes; Category: Cap; Temperature Coefficient: 20%; RoHS: TRUE; Temperature Range Low: -55°C; Octopart: https://octopart.com/f981c106msaas1-avx-49645945; Device Class L1: Passive Components
LCD1 = LCD (16:2): Display Lcd 35x75mm; MP: LM016L; MF: Hitachi; Availability: Unavailable; Package: None; Value: *; Price: None; SnapEDA_Link: https://www.snapeda.com/parts/LM016L/Hitachi/view-part/229734/?ref=snap
LED2 LED3 = Red LED: as LED1 on sheet powerAndCommunication; ComponentLink1Description: Datasheet; ComponentLink1URL: http://www.farnell.com/datasheets/2863963.pdf?_ga=2.217691222.1193962280.1589558354-303286379.1586364067&_gac=1.191757912.1589563198.Cj0KCQjw-_j1BRDkARIsAJcfmTFIG7O-lBwUzM7jXL1d54rcmK8ZCJrBZphKUIU-ia_1DnqilNgsh1YaAq1qEALw_wcB
LED4 LED5 = Green LED: Nominal current: 2mA; Nominal voltage: 1.9V
LED6 LED7 = Blue LED: Nominal current: 20ma; Nominal voltage: 3.3V
LED8 LED9 = Orange LED: Nominal current: 2mA; Nominal voltage: 1.8V
R6 R7 R9-R39 R41 R42 = Resistor: Nominal power: 125mW
R8 R40 R43 = Potentiometer: Nominal power: 125mW; Type: linear
SW3 SW5 = CMP-2000-05602-1: as SW1 on sheet core; Mechanical Life: N/A; Family: FSMJSMA; Contact Material: CopperAlloy; Type: N/A; RoHS: Yes; Pole Throw Configuration: N/A; Operating Temperature: -20to85C; Minimum Insulation Resistance: 100MOhm; Package Description: 4-Pin Surface Mount Device, Body 6 x 6 mm, Pitch 9.1 mm; Housing Material: N/A; Switch Configuration: N/A; Mounting: SurfaceMount,GullWing; Datasheet URL: https://datasheet.ciiva.com/14635/0900766b80912216-14635826.pdf; Packaging: Bulk; Base Material: N/A; Actuator Color: N/A; Dimension: 6x10x5.25mm; Contact Plating: Silver; Seal Location: N/A; Mounting Technology: SurfaceMount; Part No: 4-1437565-1; Seal Description: N/A; Maximum AC Voltage Rating: N/A; Datasheet Version: 04/2007; Manufacturer URL: http://www.te.com/; Package Reference: 4-1437565-1; Product Weight: N/A
SW4 = Joystick: 4-directional microswitch with center push; Rating: 100mA / 12V DC; Contact Resistance: 500M max.; Withstand Voltage: 250V DC (50Hz); Mechanical Life: 100000 times; Operating Force: 4 direction 160+/-50gf; center push 280+/-100gf; Movement: 4 direction 0.20+/-0.1mm; center push 0.15+/-0.1gf; ComponentLink1Description: Datasheet; ComponentLink1URL: https://www.rcscomponents.kiev.ua/datasheets/daatasheet-prztmt-01.pdf; Ambient Temperature Tange: -10*C to +60*C
T1-T8 = BC847: ComponentLink1Description: Datasheet; ComponentLink1URL: https://assets.nexperia.com/documents/data-sheet/BC856_BC857_BC858.pdf

## Sheet portsAndMemory.SchDoc
size A4
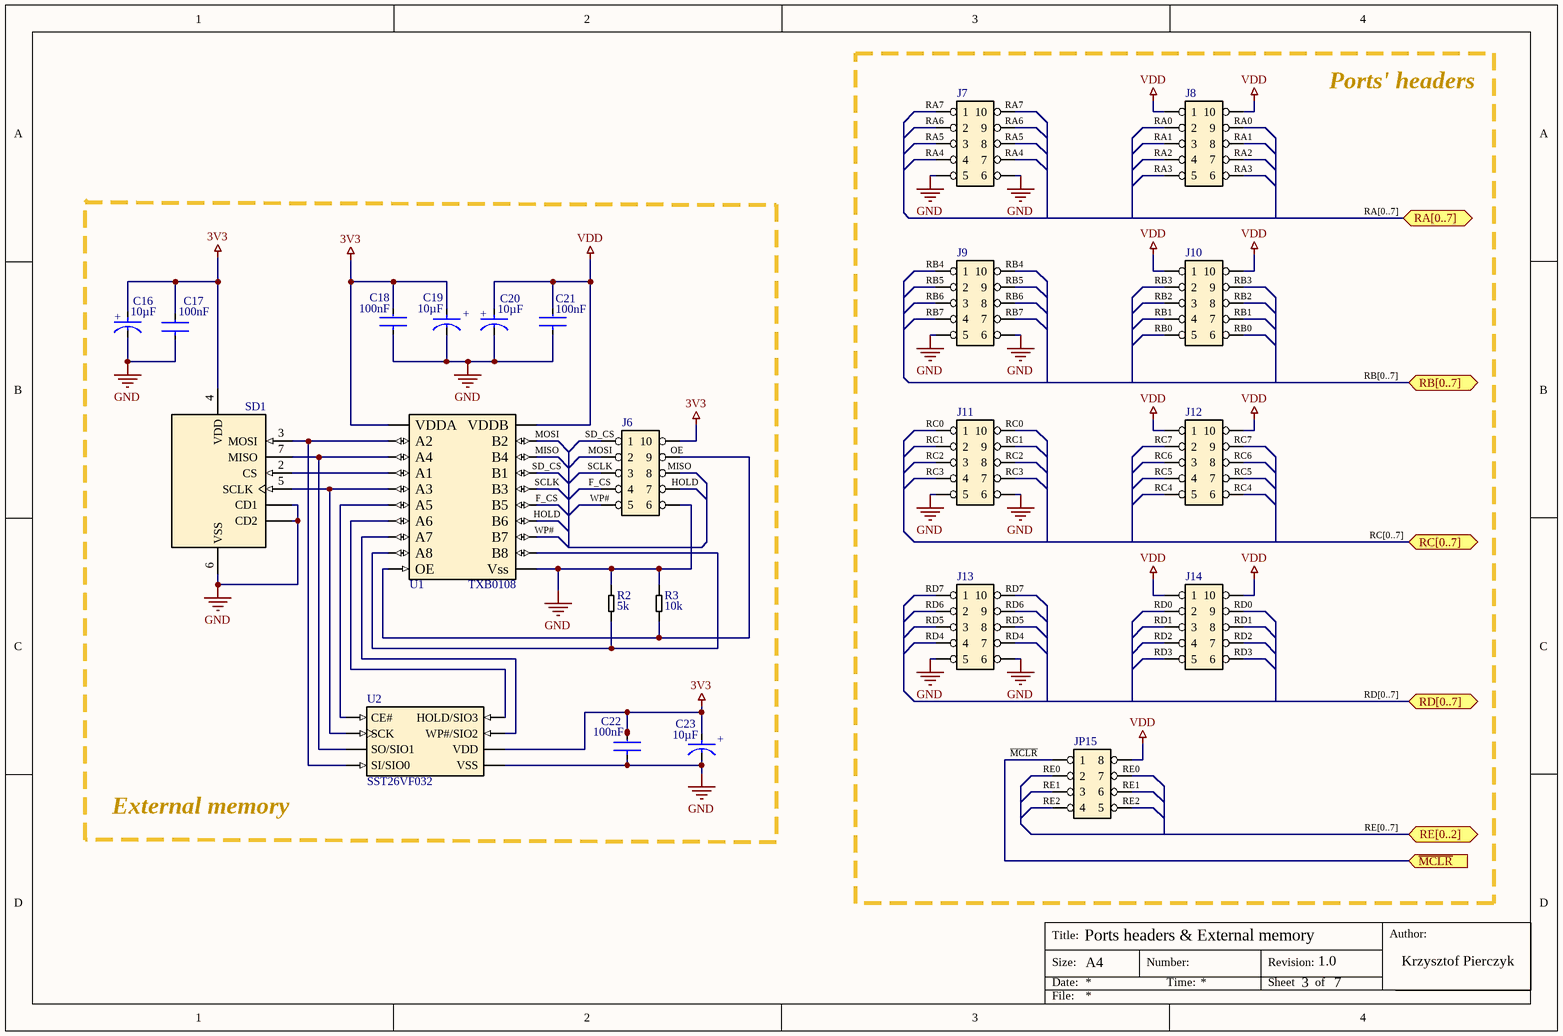
[diagram p5: portsAndMemory.SchDoc]

### Parts
C16  Capacitance: 10µF  [FP-F98S-MFG]  (hidden comment: F981C106MSAAS1)
C17  value 100nF  [FP-C0805C-DN-MFG]  (hidden comment: C0805C102J5GACTU)
C18  value 100nF  [FP-C0805C-DN-MFG]  (hidden comment: C0805C102J5GACTU)
C19  Capacitance: 10µF  [FP-F98S-MFG]  (hidden comment: F981C106MSAAS1)
C20  Capacitance: 10µF  [FP-F98S-MFG]  (hidden comment: F981C106MSAAS1)
C21  value 100nF  [FP-C0805C-DN-MFG]  (hidden comment: C0805C102J5GACTU)
C22  value 100nF  [FP-C0805C-DN-MFG]  (hidden comment: C0805C102J5GACTU)
C23  Capacitance: 10µF  [FP-F98S-MFG]  (hidden comment: F981C106MSAAS1)
J6  Header 2x5  [Header2x5]  (value not drawn)
J7  Header 2x5  [Header2x5]  (value not drawn)
J8  Header 2x5  [Header2x5]  (value not drawn)
J9  Header 2x5  [Header2x5]  (value not drawn)
J10  Header 2x5  [Header2x5]  (value not drawn)
J11  Header 2x5  [Header2x5]  (value not drawn)
J12  Header 2x5  [Header2x5]  (value not drawn)
J13  Header 2x5  [Header2x5]  (value not drawn)
J14  Header 2x5  [Header2x5]  (value not drawn)
JP15  Header 2x4  [Header 2x4]  (value not drawn)
R2  Resistance: 5k  [0805]  (hidden comment: Resistor)
R3  Resistance: 10k  [0805]  (hidden comment: Resistor)
SD1  AMPHENOL114-00841-68 (uSD)  [114-00841-68 (AMPHENOL)]  (value not drawn)
U1  TXB0108  [TSSOP-20]
U2  SST26VF032  [SOIJ-8]

### Blocks framed on the sheet
Ports' headers: J7-J14 JP15

### Ports
RA[0..7] (bidir), RB[0..7] (bidir), RC[0..7] (bidir), RD[0..7] (bidir), RE[0..2] (bidir), ~{MCLR} (in)

### Nets
3V3: C16.2(A) C17.2 C18.2 C19.2(A) C22.2 C23.2(A) J6.10 SD1.4(VDD) U1.5(VDDA) U2.8(VDD)
GND: C16.1(C) C17.1 C18.1 C19.1(C) C20.1(C) C21.1 C22.1 C23.1(C) J6.6 J7.5 J7.6 J9.5 J9.6 J11.5 J11.6 J13.5 J13.6 R2.1 R3.1 SD1.6(VSS) SD1.CD1 SD1.CD2 U1.15(Vss) U2.4(VSS)
VDD: C20.2(A) C21.2 J8.1 J8.10 J10.1 J10.10 J12.1 J12.10 J14.1 J14.10 JP15.8 U1.16(VDDB)
F_CS: J6.4 U1.14(B5)
HOLD: J6.7 U1.13(B6)
~{MCLR}: JP15.1 ; port ~{MCLR}
MISO: J6.8 U1.17(B4)
MOSI: J6.2 U1.19(B2)
RA0: J8.2 J8.9
RA1: J8.3 J8.8
RA2: J8.4 J8.7
RA3: J8.5 J8.6
RA4: J7.4 J7.7
RA5: J7.3 J7.8
RA6: J7.2 J7.9
RA7: J7.1 J7.10
RB0: J10.5 J10.6
RB1: J10.4 J10.7
RB2: J10.3 J10.8
RB3: J10.2 J10.9
RB4: J9.1 J9.10
RB5: J9.2 J9.9
RB6: J9.3 J9.8
RB7: J9.4 J9.7
RC0: J11.1 J11.10
RC1: J11.2 J11.9
RC2: J11.3 J11.8
RC3: J11.4 J11.7
RC4: J12.5 J12.6
RC5: J12.4 J12.7
RC6: J12.3 J12.8
RC7: J12.2 J12.9
RD0: J14.2 J14.9
RD1: J14.3 J14.8
RD2: J14.4 J14.7
RD3: J14.5 J14.6
RD4: J13.4 J13.7
RD5: J13.3 J13.8
RD6: J13.2 J13.9
RD7: J13.1 J13.10
RE0: JP15.2 JP15.7
RE1: JP15.3 JP15.6
RE2: JP15.4 JP15.5
SCLK: J6.3 U1.18(B3)
SD_CS: J6.1 U1.20(B1)
WP#: J6.5 U1.12(B7)
NetJ6_9: J6.9 R3.2 U1.6(OE)
NetR2_2: R2.2 U1.10(A8) U1.11(B8)
NetSD1_2: SD1.2(CS) U1.1(A1)
NetSD1_3: SD1.3(MOSI) U1.2(A2) U2.5(SI/SIO0)
NetSD1_5: SD1.5(SCLK) U1.3(A3) U2.6(SCK)
NetSD1_7: SD1.7(MISO) U1.4(A4) U2.2(SO/SIO1)
NetU1_7: U1.7(A5) U2.1(CE#)
NetU1_8: U1.8(A6) U2.7(HOLD/SIO3)
NetU1_9: U1.9(A7) U2.3(WP#/SIO2)

### Buses and harness runs
bus RA[0..7] = port RA[0..7]
bus RB[0..7] = port RB[0..7]
bus RC[0..7] = port RC[0..7]
bus RD[0..7] = port RD[0..7]
bus RE[0..7] = port RE[0..2]

### Notes on the sheet
- External memory
- Ports headers & External memory
- 3
- 1.0
- 7
- Labels drawn without touching a wire or pin: OE
- Title:
- Size:
- Date:
- A4
- Number:
- Time:
- Revision:
- Sheet
- of
- Author:
- Krzysztof Pierczyk
- File:
- (in symbol CMP-04424-000018-1) +

### Library data of the parts
C16 C19 C20 C23 = CMP-04424-000018-1: as C25 on sheet powerAndCommunication; Temperature Range High: +125°C; Temperature: -55°C to +125°C; Digikey Description: CAP TANT 10UF 20% 16V 0805; Tolerance: 20%; Automotive: No; Voltage Rating: 16V; Device Class L3: Tantalum Capacitors; Package: F98S; Device Class L2: Capacitors; Footprint Url: https://www.avx.com/download/software/literature/AVX-Footprint-Library.pdf; Mouser Description: Cap Tant Solid 10uF 16V S CASE 20% (2 x 1.25 x 0.8mm) SMD 2012-09 4.5Ohm 125°C T/R; Value: 10uF; ComponentLink2URL: http://datasheets.avx.com/F98-AS1.pdf; Height: 0.9mm; Manufacturer Part Number: F981C106MSAAS1; ComponentLink2Description: Datasheet; Lead Free: Yes; Category: Cap; Temperature Coefficient: 20%; RoHS: TRUE; Temperature Range Low: -55°C; Octopart: https://octopart.com/f981c106msaas1-avx-49645945; Device Class L1: Passive Components
C17 C18 C21 C22 = CMP-03020-008364-1: as C26 on sheet powerAndCommunication; Automotive: No; Voltage Rating: 50 V; Device Class L1: Passive Components; Digikey Description: CAP CER 1000PF 50V C0G/NP0 0805; Lead Free: Yes; Package: C0805C-DN; RoHS: TRUE; Temperature Range High: +125°C; Height: 0.88mm; Ipc Land Pattern Name: CAPC200125X78; Category: Cap; ComponentLink2URL: https://content.kemet.com/datasheets/KEM_C1003_C0G_SMD.pdf; Device Class L2: Capacitors; ComponentLink2Description: Datasheet; Temperature: -55°C to +125°C; Octopart: https://octopart.com/c0805c102j5gactu-kemet-97757; Mouser Description: Multilayer Ceramic Capacitors MLCC - SMD/SMT 50volts 1000pF C0G 5%; Manufacturer Part Number: C0805C102J5GACTU; Device Class L3: Ceramic Capacitors; Temperature Range Low: -55°C
R2 R3 = Resistor: Nominal power: 125mW
SD1 = uSD: MP: 502570-0893; MF: Molex; Price: None; Package: None; Value: *; Availability: Unavailable; SnapEDA_Link: https://www.snapeda.com/parts/502570-0893/Molex/view-part/225170/?ref=snap
U1 = TXB0108: VDDB (max): 5.5V; VDDB (min): 1.65V; VDDA (max): 3.6V; VDDA (min): 1.2V; IDDB (max): 5uA; IDDA (max): 5uA; ComponentLink1Description: Datasheet; ComponentLink1URL: http://www.ti.com/lit/ds/symlink/txb0108.pdf?&ts=1589634685869
U2 = SST26VF032: VDD (min): 2.7V; VDD (max): 3.6; ICCr @104MHz: 20mA; ICCw: 25mA; ComponentLink1Description: Datasheet; ComponentLink1URL: http://ww1.microchip.com/downloads/en/devicedoc/25017a.pdf

## Sheet sensorsAndExecutiveElements.SchDoc
size A4
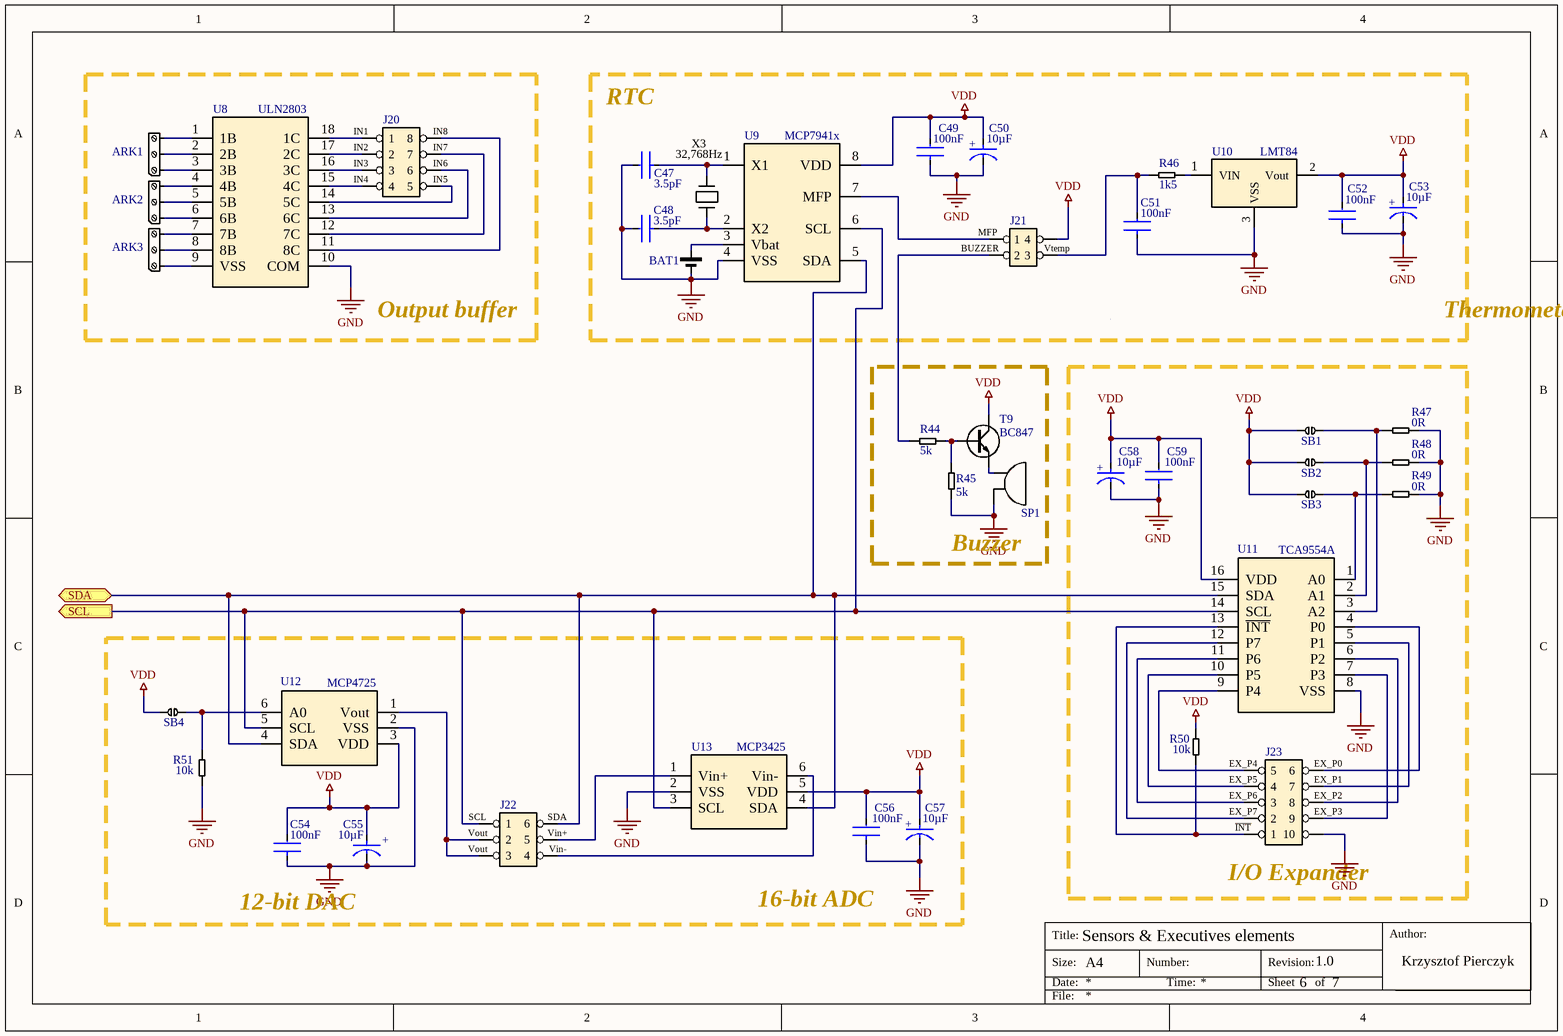
[diagram p6: sensorsAndExecutiveElements.SchDoc]

### Parts
ARK1  ARK-3  [ARK3]  (value not drawn)
ARK2  ARK-3  [ARK3]  (value not drawn)
ARK3  ARK-3  [ARK3]  (value not drawn)
BAT1  Battery  [CR2032 Holder (botland)]  (value not drawn)
C47  value 3.5pF  [FP-C0805C-DN-MFG]  (hidden comment: C0805C102J5GACTU)
C48  value 3.5pF  [FP-C0805C-DN-MFG]  (hidden comment: C0805C102J5GACTU)
C49  value 100nF  [FP-C0805C-DN-MFG]  (hidden comment: C0805C102J5GACTU)
C50  Capacitance: 10µF  [FP-F98S-MFG]  (hidden comment: F981C106MSAAS1)
C51  value 100nF  [FP-C0805C-DN-MFG]  (hidden comment: C0805C102J5GACTU)
C52  value 100nF  [FP-C0805C-DN-MFG]  (hidden comment: C0805C102J5GACTU)
C53  Capacitance: 10µF  [FP-F98S-MFG]  (hidden comment: F981C106MSAAS1)
C54  value 100nF  [FP-C0805C-DN-MFG]  (hidden comment: C0805C102J5GACTU)
C55  Capacitance: 10µF  [FP-F98S-MFG]  (hidden comment: F981C106MSAAS1)
C56  value 100nF  [FP-C0805C-DN-MFG]  (hidden comment: C0805C102J5GACTU)
C57  Capacitance: 10µF  [FP-F98S-MFG]  (hidden comment: F981C106MSAAS1)
C58  Capacitance: 10µF  [FP-F98S-MFG]  (hidden comment: F981C106MSAAS1)
C59  value 100nF  [FP-C0805C-DN-MFG]  (hidden comment: C0805C102J5GACTU)
J20  Header 2x4  [Header 2x4]  (value not drawn)
J21  Header 2x2  [Header 2x2]  (value not drawn)
J22  Header 2x3  [Header 2x3]  (value not drawn)
J23  Header 2x5  [Header2x5]  (value not drawn)
R44  Resistance: 5k  [0805]  (hidden comment: Resistor)
R45  Resistance: 5k  [0805]  (hidden comment: Resistor)
R46  Resistance: 1k5  [0805]  (hidden comment: Resistor)
R47  Resistance: 0R  [0805]  (hidden comment: Resistor)
R48  Resistance: 0R  [0805]  (hidden comment: Resistor)
R49  Resistance: 0R  [0805]  (hidden comment: Resistor)
R50  Resistance: 10k  [0805]  (hidden comment: Resistor)
R51  Resistance: 10k  [0805]  (hidden comment: Resistor)
SB1  Bridge  [0805]  (value not drawn)
SB2  Bridge  [0805]  (value not drawn)
SB3  Bridge  [0805]  (value not drawn)
SB4  Bridge  [0805]  (value not drawn)
SP1  Buzzer  [Buzzer 3-16V (botland)]  (value not drawn)
T9  BC847  [SOT-23-3]
U8  ULN2803  [SOIC-18 (300MIL)]
U9  MCP7941x  [SOIC-8]
U10  LMT84  [TO-92 (STRAIGHT)]
U11  TCA9554A  [TSSOP-16]
U12  MCP4725  [SOT-23-6]
U13  MCP3425  [SOT-23-6]
X3  Frequency: 32,768Hz  [X32K768S315]  (hidden comment: Crystal)

### Blocks framed on the sheet
Output buffer: ARK1-ARK3 J20 U8
Buzzer: R44 R45 SP1 T9
I/O Expander: C58 C59 J23 R47-R50 SB1-SB3 U11

### Ports
SCL (out), SDA (bidir)

### Nets
GND: BAT1.2(-) C47.2 C48.2 C49.1 C50.1(C) C51.1 C52.1 C53.1(C) C54.1 C55.1(C) C56.1 C57.1(C) C58.1(C) C59.1 J23.10 R45.1 R47.1 R48.1 R49.1 R51.2 SP1.2 U8.10(COM) U9.4(VSS) U10.3(VSS) U11.8(VSS) U12.2(VSS) U13.2(VSS)
VDD: C49.2 C50.2(A) C52.2 C53.2(A) C54.2 C55.2(A) C56.2 C57.2(A) C58.2(A) C59.2 J21.4 R50.2 SB1.1 SB2.1 SB3.1 SB4.1 T9.3(C) U9.8(VDD) U10.2(Vout) U11.16(VDD) U12.3(VDD) U13.5(VDD)
BUZZER: J21.2 R44.1
EX_P0: J23.6 U11.4(P0)
EX_P1: J23.7 U11.5(P1)
EX_P2: J23.8 U11.6(P2)
EX_P3: J23.9 U11.7(P3)
EX_P4: J23.5 U11.9(P4)
EX_P5: J23.4 U11.10(P5)
EX_P6: J23.3 U11.11(P6)
EX_P7: J23.2 U11.12(P7)
~{INT}: J23.1 R50.1 U11.13(~{INT})
IN1: J20.1 U8.18(1C)
IN2: J20.2 U8.17(2C)
IN3: J20.3 U8.16(3C)
IN4: J20.4 U8.15(4C)
IN5: J20.5 U8.14(5C)
IN6: J20.6 U8.13(6C)
IN7: J20.7 U8.12(7C)
IN8: J20.8 U8.11(8C)
MFP: J21.1 U9.7(MFP)
SCL: J22.1 U9.6(SCL) U11.14(SCL) U12.5(SCL) U13.3(SCL) ; port SCL
SDA: J22.6 U9.5(SDA) U11.15(SDA) U12.4(SDA) U13.4(SDA) ; port SDA
Vin+: J22.5 U13.1(Vin+)
Vin-: J22.4 U13.6(Vin-)
Vout: J22.2 J22.3 U12.1(Vout)
Vtemp: C51.2 J21.3 R46.2
NetARK1_1: ARK1.1 U8.3(3B)
NetARK1_2: ARK1.2 U8.2(2B)
NetARK1_3: ARK1.3 U8.1(1B)
NetARK2_1: ARK2.1 U8.6(6B)
NetARK2_2: ARK2.2 U8.5(5B)
NetARK2_3: ARK2.3 U8.4(4B)
NetARK3_1: ARK3.1 U8.9(VSS)
NetARK3_2: ARK3.2 U8.8(8B)
NetARK3_3: ARK3.3 U8.7(7B)
NetBAT1_1: BAT1.1(+) U9.3(Vbat)
NetC47_1: C47.1 U9.1(X1) X3.1
NetC48_1: C48.1 U9.2(X2) X3.2
NetR44_2: R44.2 R45.2 T9.1(B)
NetR46_1: R46.1 U10.1(VIN)
NetR47_2: R47.2 SB1.2 U11.3(A2)
NetR48_2: R48.2 SB2.2 U11.2(A1)
NetR49_2: R49.2 SB3.2 U11.1(A0)
NetR51_1: R51.1 SB4.2 U12.6(A0)
NetSP1_1: SP1.1 T9.2(E)

### Notes on the sheet
- (near C47) RTC
- Thermometer
- 12-bit DAC
- 16-bit ADC
- Sensors & Executives elements
- 6
- 1.0
- 7
- Title:
- Size:
- Date:
- A4
- Number:
- Time:
- Revision:
- Sheet
- of
- Author:
- Krzysztof Pierczyk
- File:
- (in symbol CMP-04424-000018-1) +

### Library data of the parts
C47-C49 C51 C52 C54 C56 C59 = CMP-03020-008364-1: as C26 on sheet powerAndCommunication; Automotive: No; Voltage Rating: 50 V; Device Class L1: Passive Components; Digikey Description: CAP CER 1000PF 50V C0G/NP0 0805; Lead Free: Yes; Package: C0805C-DN; RoHS: TRUE; Temperature Range High: +125°C; Height: 0.88mm; Ipc Land Pattern Name: CAPC200125X78; Category: Cap; ComponentLink2URL: https://content.kemet.com/datasheets/KEM_C1003_C0G_SMD.pdf; Device Class L2: Capacitors; ComponentLink2Description: Datasheet; Temperature: -55°C to +125°C; Octopart: https://octopart.com/c0805c102j5gactu-kemet-97757; Mouser Description: Multilayer Ceramic Capacitors MLCC - SMD/SMT 50volts 1000pF C0G 5%; Manufacturer Part Number: C0805C102J5GACTU; Device Class L3: Ceramic Capacitors; Temperature Range Low: -55°C
C50 C53 C55 C57 C58 = CMP-04424-000018-1: as C25 on sheet powerAndCommunication; Temperature Range High: +125°C; Temperature: -55°C to +125°C; Digikey Description: CAP TANT 10UF 20% 16V 0805; Tolerance: 20%; Automotive: No; Voltage Rating: 16V; Device Class L3: Tantalum Capacitors; Package: F98S; Device Class L2: Capacitors; Footprint Url: https://www.avx.com/download/software/literature/AVX-Footprint-Library.pdf; Mouser Description: Cap Tant Solid 10uF 16V S CASE 20% (2 x 1.25 x 0.8mm) SMD 2012-09 4.5Ohm 125°C T/R; Value: 10uF; ComponentLink2URL: http://datasheets.avx.com/F98-AS1.pdf; Height: 0.9mm; Manufacturer Part Number: F981C106MSAAS1; ComponentLink2Description: Datasheet; Lead Free: Yes; Category: Cap; Temperature Coefficient: 20%; RoHS: TRUE; Temperature Range Low: -55°C; Octopart: https://octopart.com/f981c106msaas1-avx-49645945; Device Class L1: Passive Components
R44-R51 = Resistor: Nominal power: 125mW
U8 = ULN2803: Vce: 50V; Vi: 30V; Iec: 500mA; ComponentLink1Description: Datasheet; ComponentLink1URL: http://www.ti.com/lit/ds/symlink/uln2803a.pdf?&ts=1589632455566
U9 = MCP7941x: VDD (min): 1.8V; VDD (max): 5.5V; ComponentLink1Description: Datasheet; ComponentLink1URL: http://ww1.microchip.com/downloads/en/DeviceDoc/22266B.pdf
U10 = LMT84: VDD (min): 1.5V; VDD (max): 5.5V; IDD: 9uA; ComponentLink1Description: Datasheet; ComponentLink1URL: http://www.ti.com/lit/ds/symlink/lmt84.pdf?&ts=1589637241911
U11 = TCA9554A: VDD (min): 1.65V; VDD (max): 5.5V; ICC: 80mA; ComponentLink1Description: Datasheet; ComponentLink1URL: http://www.ti.com/lit/ds/symlink/tca9554a.pdf?&ts=1589634702475
U12 = MCP4725: VDD (min): 2.7V; VDD (max): 5.5V; ICC (max): 400uA; ComponentLink1Description: Datasheet; ComponentLink1URL: http://ww1.microchip.com/downloads/en/devicedoc/22039d.pdf
U13 = MCP3425: VDD (min): 2.7V; VDD (max): 5.5V; ICC (max): 400uA; ComponentLink1Description: Datasheet; ComponentLink1URL: https://ww1.microchip.com/downloads/en/DeviceDoc/22072b.pdf
T9 = BC847: ComponentLink1Description: Datasheet; ComponentLink1URL: https://assets.nexperia.com/documents/data-sheet/BC856_BC857_BC858.pdf
X3 = Crystal: ComponentLink1Description: Datasheet; ComponentLink1URL: https://www.4timing.com/specification/hc49smp.pdf